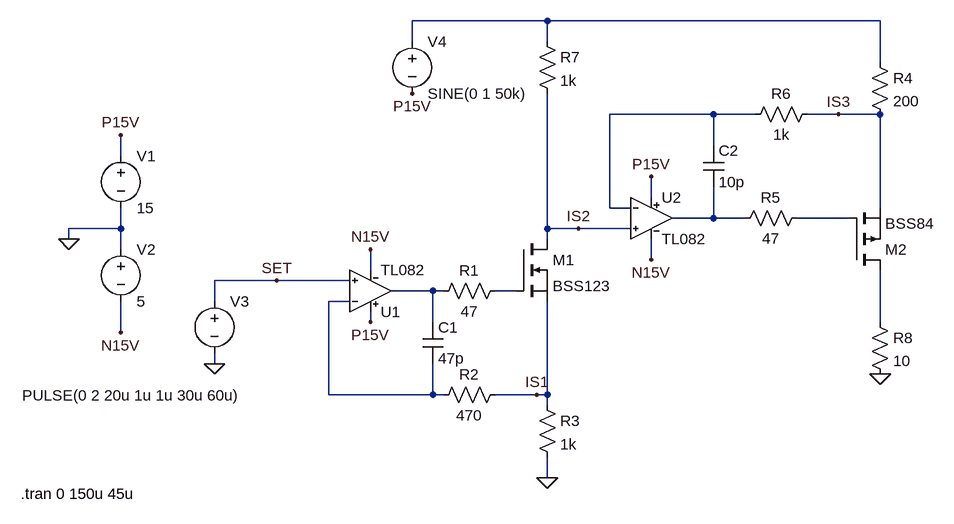
[diagram p0: schematic Programmable_CurrentSource.asc]
Programmable_CurrentSource.asc, the LTspice schematic file:
Version 4
SHEET 1 900 680
WIRE 304 -208 96 -208
WIRE 816 -208 304 -208
WIRE 96 -176 96 -208
WIRE 304 -176 304 -208
WIRE 816 -144 816 -208
WIRE 560 -64 400 -64
WIRE 624 -64 560 -64
WIRE 752 -64 704 -64
WIRE 816 -64 752 -64
WIRE 560 -16 560 -64
WIRE -352 0 -352 -32
WIRE 464 64 464 32
WIRE 400 80 400 -64
WIRE 432 80 400 80
WIRE 816 80 816 -64
WIRE 560 96 560 48
WIRE 560 96 496 96
WIRE 608 96 560 96
WIRE 768 96 688 96
WIRE -352 112 -352 80
WIRE -352 112 -432 112
WIRE 304 112 304 -96
WIRE 352 112 304 112
WIRE 432 112 352 112
WIRE -432 128 -432 112
WIRE 304 128 304 112
WIRE -352 144 -352 112
WIRE 464 160 464 128
WIRE 32 176 32 144
WIRE -112 192 -208 192
WIRE 0 192 -112 192
WIRE 128 208 64 208
WIRE 144 208 128 208
WIRE 256 208 224 208
WIRE -208 224 -208 192
WIRE 0 224 -32 224
WIRE 32 256 32 240
WIRE 128 256 128 208
WIRE 816 256 816 176
WIRE -352 272 -352 224
WIRE -208 320 -208 304
WIRE -32 368 -32 224
WIRE 128 368 128 320
WIRE 128 368 -32 368
WIRE 144 368 128 368
WIRE 288 368 224 368
WIRE 304 368 304 224
WIRE 304 368 288 368
WIRE 304 384 304 368
WIRE 304 496 304 464
FLAG -432 128 0
FLAG -352 -32 P15V
FLAG 32 256 P15V
FLAG 464 32 P15V
FLAG -352 272 N15V
FLAG 32 144 N15V
FLAG 464 160 N15V
FLAG -208 320 0
FLAG 304 496 0
FLAG 816 336 0
FLAG -112 192 SET
FLAG 288 368 IS1
FLAG 96 -96 P15V
FLAG 352 112 IS2
FLAG 752 -64 IS3
SYMBOL voltage -352 -16 R0
WINDOW 123 0 0 Left 0
WINDOW 39 0 0 Left 0
SYMATTR InstName V1
SYMATTR Value 15
SYMBOL voltage -352 128 R0
WINDOW 123 0 0 Left 0
WINDOW 39 0 0 Left 0
SYMATTR InstName V2
SYMATTR Value 5
SYMBOL TL082 32 272 M180
SYMATTR InstName U1
SYMBOL TL082 464 32 R0
SYMATTR InstName U2
SYMBOL voltage -208 208 R0
WINDOW 3 -296 161 Left 2
WINDOW 123 0 0 Left 0
WINDOW 39 0 0 Left 0
SYMATTR InstName V3
SYMATTR Value PULSE(0 2 20u 1u 1u 30u 60u)
SYMBOL res 240 192 R90
WINDOW 0 0 56 VBottom 2
WINDOW 3 32 56 VTop 2
SYMATTR InstName R1
SYMATTR Value 47
SYMBOL res 240 352 R90
WINDOW 0 0 56 VBottom 2
WINDOW 3 32 56 VTop 2
SYMATTR InstName R2
SYMATTR Value 470
SYMBOL cap 112 256 R0
SYMATTR InstName C1
SYMATTR Value 47p
SYMBOL res 288 368 R0
SYMATTR InstName R3
SYMATTR Value 1k
SYMBOL nmos 256 128 R0
SYMATTR InstName M1
SYMATTR Value BSS123
SYMBOL pmos 768 176 M180
SYMATTR InstName M2
SYMATTR Value BSS84
SYMBOL res 800 -160 R0
SYMATTR InstName R4
SYMATTR Value 200
SYMBOL res 704 80 R90
WINDOW 0 0 56 VBottom 2
WINDOW 3 32 56 VTop 2
SYMATTR InstName R5
SYMATTR Value 47
SYMBOL res 720 -80 R90
WINDOW 0 0 56 VBottom 2
WINDOW 3 32 56 VTop 2
SYMATTR InstName R6
SYMATTR Value 1k
SYMBOL cap 544 -16 R0
SYMATTR InstName C2
SYMATTR Value 10p
SYMBOL res 288 -192 R0
SYMATTR InstName R7
SYMATTR Value 1k
SYMBOL res 800 240 R0
SYMATTR InstName R8
SYMATTR Value 10
SYMBOL voltage 96 -192 R0
WINDOW 123 0 0 Left 0
WINDOW 39 0 0 Left 0
SYMATTR InstName V4
SYMATTR Value SINE(0 1 50k)
TEXT -506 520 Left 2 !.tran 0 150u 45u

The netlist it stands for:
* Programmable_CurrentSource.asc
V1 P15V 0 15
V2 0 N15V 5
XU1 SET N007 P15V N15V N005 AD549  ; pins In+ In- V+ V- OUT
XU2 IS2 N002 P15V N15V N003 AD549  ; pins In+ In- V+ V- OUT
V3 SET 0 PULSE(0 2 20u 1u 1u 30u 60u)
R1 N006 N005 47
R2 IS1 N007 470
C1 N005 N007 47p
R3 IS1 0 1k
M1 IS2 N006 IS1 IS1 BSS123
M2 N008 N004 IS3 IS3 BSS84
R4 N001 IS3 200
R5 N004 N003 47
R6 IS3 N002 1k
C2 N002 N003 10p
R7 N001 IS2 1k
R8 N008 0 10
V4 N001 P15V SINE(0 1 50k)
.model NMOS NMOS
.model PMOS PMOS
.lib standard.mos
.tran 0 150u 45u
.lib ADI1.lib
.backanno
.end